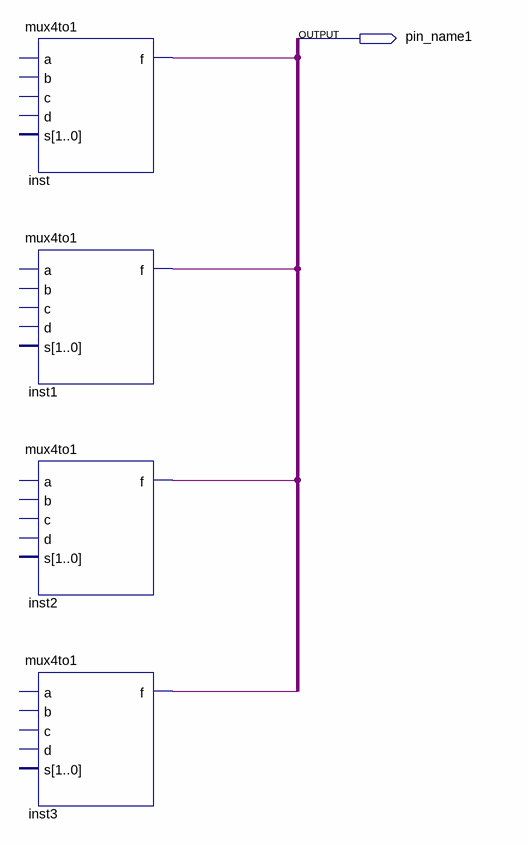
[diagram p0: schematic sheet]
// Quartus schematic Lab8step2.bdf as structural Verilog: 4 symbols, 1 pins
module Lab8step2 (
  output pin_name1
);

  mux4to1 inst (.f(pin_name1));  // open: a, b, c, d, s
  mux4to1 inst1 (.f(pin_name1));  // open: a, b, c, d, s
  mux4to1 inst2 (.f(pin_name1));  // open: a, b, c, d, s
  mux4to1 inst3 (.f(pin_name1));  // open: a, b, c, d, s
endmodule
